# Altium schematic sheet AmplifierInput.SchDoc
size B
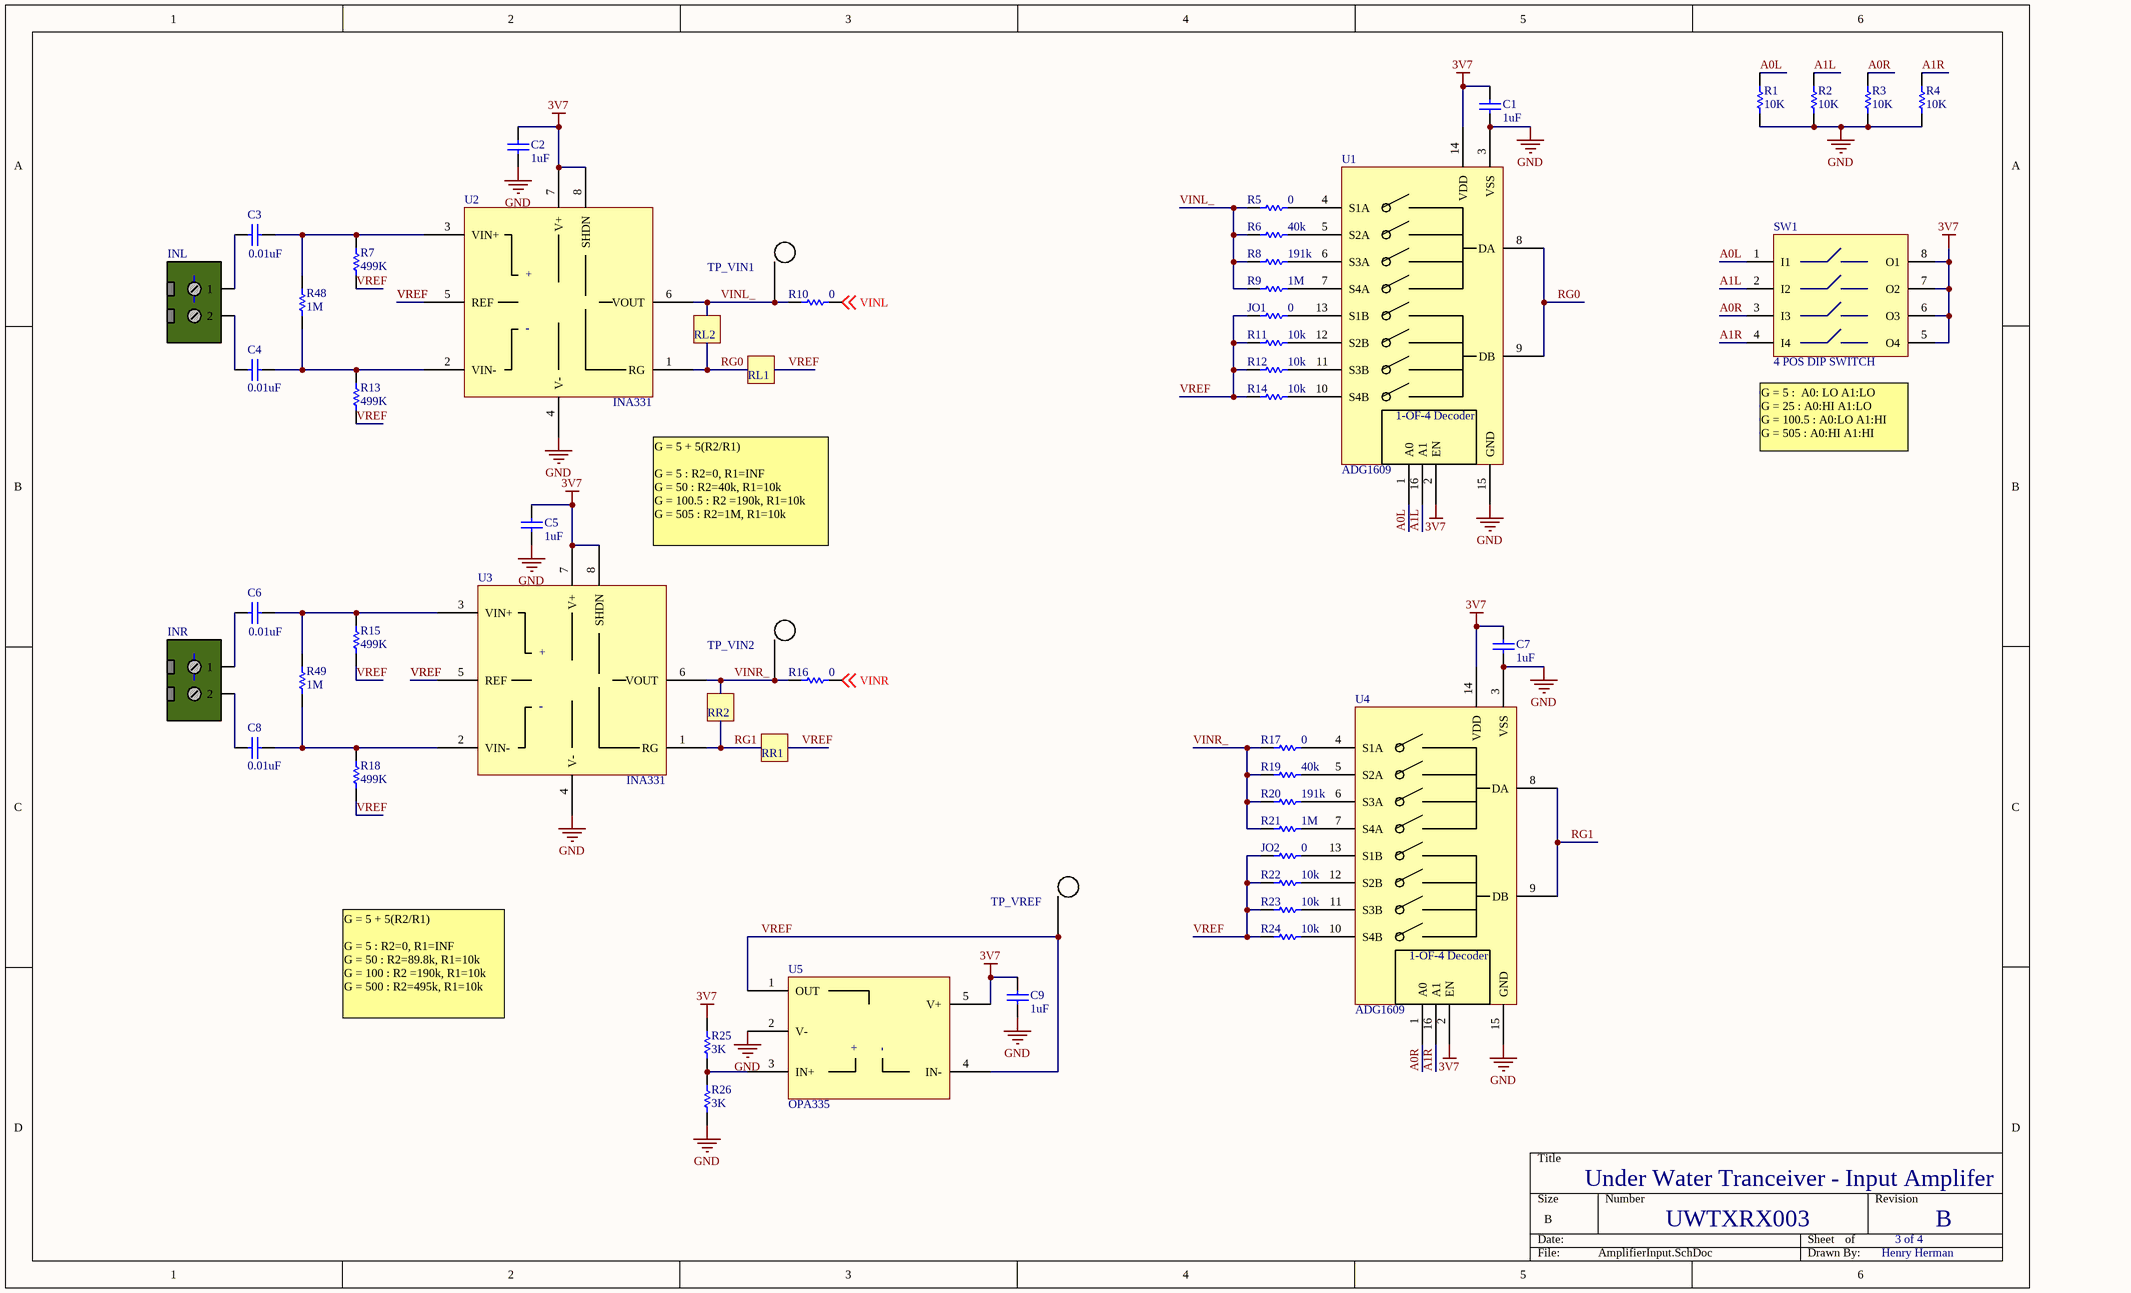
[diagram p0: AmplifierInput.SchDoc]

## Parts
C1  value 1uF  [SM/C_0805]  (hidden comment: CAP)
C2  value 1uF  [SM/C_0805]  (hidden comment: CAP)
C3  value 0.01uF  [SM/C_0805]  (hidden comment: CAP)
C4  value 0.01uF  [SM/C_0805]  (hidden comment: CAP)
C5  value 1uF  [SM/C_0805]  (hidden comment: CAP)
C6  value 0.01uF  [SM/C_0805]  (hidden comment: CAP)
C7  value 1uF  [SM/C_0805]  (hidden comment: CAP)
C8  value 0.01uF  [SM/C_0805]  (hidden comment: CAP)
C9  value 1uF  [SM/C_0805]  (hidden comment: CAP)
INL  TERM BLOCK 2POS  [Conn-ScrewTerminal-2pin-Phoenix]  (value not drawn)
INR  TERM BLOCK 2POS  [Conn-ScrewTerminal-2pin-Phoenix]  (value not drawn)
JO1  value 0  [SM/R_0805]  (hidden comment: Res)
JO2  value 0  [SM/R_0805]  (hidden comment: Res)
R1  value 10K  [SM/R_0805]  (hidden comment: Res)
R2  value 10K  [SM/R_0805]  (hidden comment: Res)
R3  value 10K  [SM/R_0805]  (hidden comment: Res)
R4  value 10K  [SM/R_0805]  (hidden comment: Res)
R5  value 0  [SM/R_0805]  (hidden comment: Res)
R6  value 40k  [SM/R_0805]  (hidden comment: Res)
R7  value 499K  [SM/R_0805]  (hidden comment: Res)
R8  value 191k  [SM/R_0805]  (hidden comment: Res)
R9  value 1M  [SM/R_0805]  (hidden comment: Res)
R10  value 0  [SM/R_0805]  (hidden comment: Res)
R11  value 10k  [SM/R_0805]  (hidden comment: Res)
R12  value 10k  [SM/R_0805]  (hidden comment: Res)
R13  value 499K  [SM/R_0805]  (hidden comment: Res)
R14  value 10k  [SM/R_0805]  (hidden comment: Res)
R15  value 499K  [SM/R_0805]  (hidden comment: Res)
R16  value 0  [SM/R_0805]  (hidden comment: Res)
R17  value 0  [SM/R_0805]  (hidden comment: Res)
R18  value 499K  [SM/R_0805]  (hidden comment: Res)
R19  value 40k  [SM/R_0805]  (hidden comment: Res)
R20  value 191k  [SM/R_0805]  (hidden comment: Res)
R21  value 1M  [SM/R_0805]  (hidden comment: Res)
R22  value 10k  [SM/R_0805]  (hidden comment: Res)
R23  value 10k  [SM/R_0805]  (hidden comment: Res)
R24  value 10k  [SM/R_0805]  (hidden comment: Res)
R25  value 3K  [SM/R_0805]  (hidden comment: Res)
R26  value 3K  [SM/R_0805]  (hidden comment: Res)
R48  value 1M  [SM/R_0805]  (hidden comment: Res)
R49  value 1M  [SM/R_0805]  (hidden comment: Res)
SW1  4 POS DIP SWITCH  [DIPSW4PIN]
TP_VIN1  TEST_PT  [TEST_PT_SMD]  (value not drawn)
TP_VIN2  TEST_PT  [TEST_PT_SMD]  (value not drawn)
TP_VREF  TEST_PT  [TEST_PT_SMD]  (value not drawn)
U1  ADG1609  [TSSOP 16LEAD - Analog Devices - ADG1609]
U2  INA331  [MSOP-8PIN-TI]
U3  INA331  [MSOP-8PIN-TI]
U4  ADG1609  [TSSOP 16LEAD - Analog Devices - ADG1609]
U5  OPA335  [SOT23-5 -TI]

## Nets
3V7: C1.1 C2.1 C5.1 C7.1 C9.1 R25.1 SW1.5(O4) SW1.6(O3) SW1.7(O2) SW1.8(O1) U1.2(EN) U1.14(VDD) U2.7(V+) U2.8(SHDN) U3.7(V+) U3.8(SHDN) U4.2(EN) U4.14(VDD) U5.5(V+)
GND: C1.2 C2.2 C5.2 C7.2 C9.2 R1.1 R2.1 R3.1 R4.1 R26.2 U1.3(VSS) U1.15(GND) U2.4(V-) U3.4(V-) U4.3(VSS) U4.15(GND) U5.2(V-)
A0L: R1.2 SW1.1(I1) U1.1(A0)
A0R: R3.2 SW1.3(I3) U4.1(A0)
A1L: R2.2 SW1.2(I2) U1.16(A1)
A1R: R4.2 SW1.4(I4) U4.16(A1)
RG0: U1.8(DA) U1.9(DB) U2.1(RG)
RG1: U3.1(RG) U4.8(DA) U4.9(DB)
VINL: R10.1 ; off-sheet VINL
VINL_: R5.2 R6.2 R8.2 R9.2 R10.2 TP_VIN1.1(TP?) U2.6(VOUT)
VINR: R16.1 ; off-sheet VINR
VINR_: R16.2 R17.2 R19.2 R20.2 R21.2 TP_VIN2.1(TP?) U3.6(VOUT)
VREF: JO1.2 JO2.2 R7.2 R11.2 R12.2 R13.2 R14.2 R15.2 R18.2 R22.2 R23.2 R24.2 TP_VREF.1(TP?) U2.5(REF) U3.5(REF) U5.1(OUT) U5.4(IN-)
NetC3_1: C3.1 R7.1 R48.1 U2.3(VIN+)
NetC3_2: C3.2 INL.1
NetC4_1: C4.1 R13.1 R48.2 U2.2(VIN-)
NetC4_2: C4.2 INL.2
NetC6_1: C6.1 R15.1 R49.1 U3.3(VIN+)
NetC6_2: C6.2 INR.1
NetC8_1: C8.1 R18.1 R49.2 U3.2(VIN-)
NetC8_2: C8.2 INR.2
NetJO1_1: JO1.1 U1.13(S1B)
NetJO2_1: JO2.1 U4.13(S1B)
NetR5_1: R5.1 U1.4(S1A)
NetR6_1: R6.1 U1.5(S2A)
NetR8_1: R8.1 U1.6(S3A)
NetR9_1: R9.1 U1.7(S4A)
NetR11_1: R11.1 U1.12(S2B)
NetR12_1: R12.1 U1.11(S3B)
NetR14_1: R14.1 U1.10(S4B)
NetR17_1: R17.1 U4.4(S1A)
NetR19_1: R19.1 U4.5(S2A)
NetR20_1: R20.1 U4.6(S3A)
NetR21_1: R21.1 U4.7(S4A)
NetR22_1: R22.1 U4.12(S2B)
NetR23_1: R23.1 U4.11(S3B)
NetR24_1: R24.1 U4.10(S4B)
NetR25_2: R25.2 R26.1 U5.3(IN+)

## Notes on the sheet
- (near U2) RL2
- RL1
- (near SW1) G = 5 :  A0: LO A1:LO
  G = 25 : A0:HI A1:LO
  G = 100.5 : A0:LO A1:HI
  G = 505 : A0:HI A1:HI
- G = 5 + 5(R2/R1)
  G = 5 : R2=0, R1=INF
  G = 50 : R2=40k, R1=10k
  G = 100.5 : R2 =190k, R1=10k
  G = 505 : R2=1M, R1=10k
- (near U3) RR2
- RR1
- G = 5 + 5(R2/R1)
  G = 5 : R2=0, R1=INF
  G = 50 : R2=89.8k, R1=10k
  G = 100 : R2 =190k, R1=10k
  G = 500 : R2=495k, R1=10k
- Under Water Tranceiver - Input Amplifer
- UWTXRX003
- 3 of 4
- B
- Henry Herman
- (in symbol ADG1609) 1-OF-4 Decoder
- (in symbol INA331) +; -
- (in symbol OPA335) +; -

## Library data of the parts
INL INR = 2Pin-PhoenixTerminalBlock
JO1 JO2 R1-R26 R48 R49 = Res: Resistor; Published: 8-Jun-2000; LatestRevisionDate: 17-Jul-2002; LatestRevisionNote: Re-released for DXP Platform.; PackageReference: AXIAL-0.3; Publisher: Altium Limited